# Altium schematic sheet untitled.SchDoc
size 209 x 148 mm
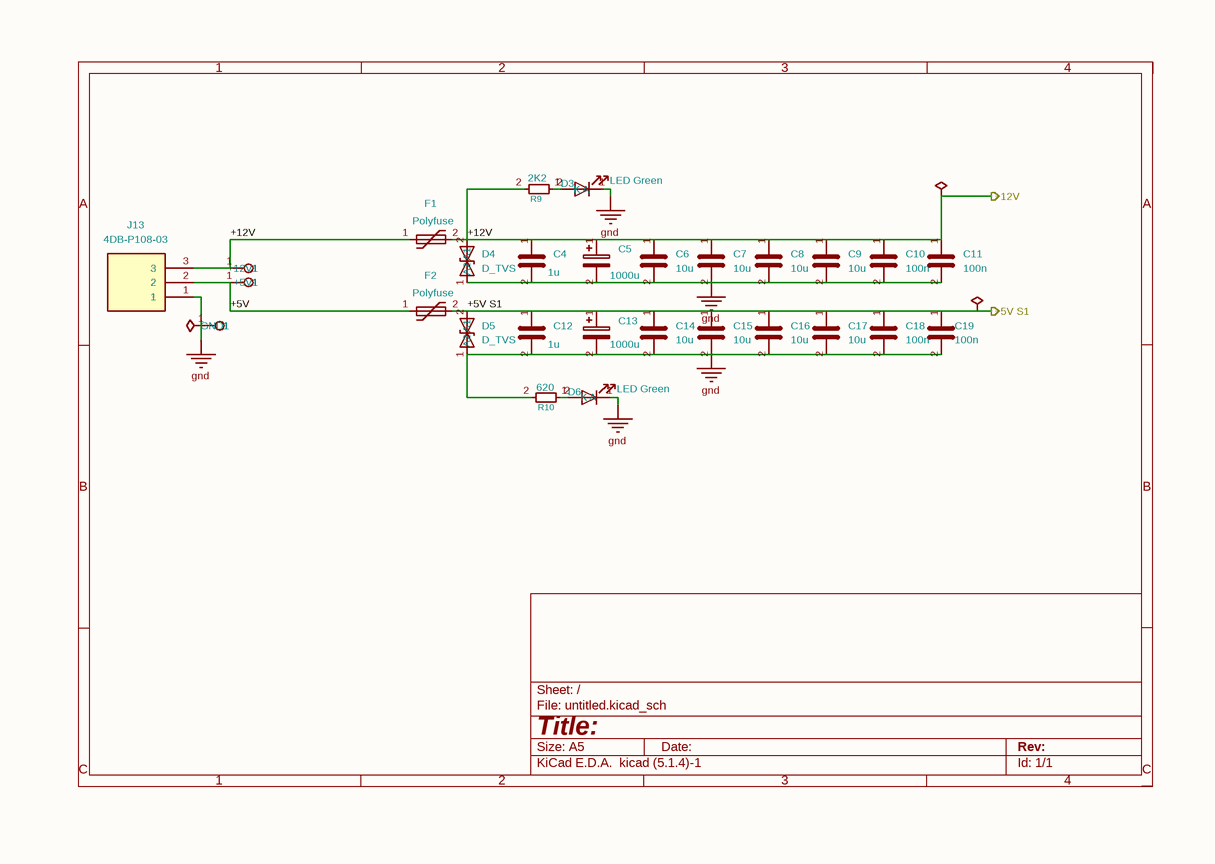
[diagram p0: untitled.SchDoc]

## Parts
#FLG01  PWR_FLAG  (value not drawn)  (graphical)
#FLG02  PWR_FLAG  (value not drawn)  (graphical)
#FLG03  PWR_FLAG  (value not drawn)  (graphical)
+5V1  TestPoint  [TestPoint_Pad_1.0x1.0mm]  (value not drawn)
+12V1  TestPoint  [TestPoint_Pad_1.0x1.0mm]  (value not drawn)
C4  1u  [C_1210_3225Metric]
C5  1000u  [EEE0JA152UAP]
C6  10u  [C_1210_3225Metric]
C7  10u  [C_1210_3225Metric]
C8  10u  [C_1210_3225Metric]
C9  10u  [C_1210_3225Metric]
C10  100n  [C_0402_1005Metric]
C11  100n  [C_0402_1005Metric]
C12  1u  [C_1210_3225Metric]
C13  1000u  [EEE0JA152UAP]
C14  10u  [C_1210_3225Metric]
C15  10u  [C_1210_3225Metric]
C16  10u  [C_1210_3225Metric]
C17  10u  [C_1210_3225Metric]
C18  100n  [C_0402_1005Metric]
C19  100n  [C_0402_1005Metric]
D3  LED Green  [LED_0603_1608Metric]
D4  D_TVS  [SMBJ12A]
D5  D_TVS  [SMBJ5.0A]
D6  LED Green  [LED_0603_1608Metric]
F1  Polyfuse  [RGEF1200]
F2  Polyfuse  [RGEF1200]
GND1  TestPoint  [TestPoint_Pad_1.0x1.0mm]  (value not drawn)
J13  4DB-P108-03  [4DBP10803]
R9  2K2  [R_0603_1608Metric]
R10  620  [R_0603_1608Metric]

## Ports
+5V S1 (out), +12V (out)

## Nets
gnd: #FLG03.1 C4.2 C5.2 C6.2 C7.2 C8.2 C9.2 C10.2 C11.2 C12.2 C13.2 C14.2 C15.2 C16.2 C17.2 C18.2 C19.2 D3.1(K) D4.1(A1) D5.1(A1) D6.1(K) GND1.1 J13.1 R10.2
+5V: +5V1.1 F2.1 J13.2
+5V S1: #FLG02.1 C12.1 C13.1 C14.1 C15.1 C16.1 C17.1 C18.1 C19.1 D5.2(A2) F2.2 ; port +5V S1
+12V: #FLG01.1 +12V1.1 C4.1 C5.1 C6.1 C7.1 C8.1 C9.1 C10.1 C11.1 D4.2(A2) F1.1 F1.2 J13.3 R9.2 ; port +12V
NetD3_2: D3.2(A) R9.1
NetD6_2: D6.2(A) R10.1

## Notes on the sheet
- 1
- 2
- 3
- 4
- A
- B
- Title:
- File: untitled.kicad_sch
- Sheet: /
- C
- KiCad E.D.A.  kicad (5.1.4)-1
- Size: A5
- Date:
- Rev:
- Id: 1/1

## Library data of the parts
#FLG01 #FLG02 #FLG03 = PWR_FLAG: Description: Special symbol for telling ERC where power comes from; Value: PWR_FLAG
C4 C6-C12 C14-C19 = C: Description: Unpolarized capacitor
  C4 C12: Value: 1u; Footprint: Capacitor_SMD:C_1210_3225Metric
  C6-C9 C14-C17: Value: 10u; Footprint: Capacitor_SMD:C_1210_3225Metric
  C10 C11 C18 C19: Value: 100n; Footprint: Capacitor_SMD:C_0402_1005Metric
C5 C13 = C_Polarized: Description: Polarized capacitor; Value: 1000u; Footprint: EEE0JA152UAP:EEE0JA152UAP
D3 D6 = LED: Part Description: Green 572nm LED Indication - Discrete 2.2V 2-SMD, No Lead; Field4: Digikey; Field5: LTST-S270KGKT; Field6: SML-A12M8TT86N; Field7: Rohm; Field8: 650263301; Value: LED Green; Footprint: LED_SMD:LED_0603_1608Metric
D4 D5 = D_TVS: Description: Bidirectional transient-voltage-suppression diode; Value: D_TVS
  D4: Footprint: SMBJ12A:SMBJ12A
  D5: Footprint: SMBJ5.0A:SMBJ5.0A
F1 F2 = Polyfuse: Description: Resettable fuse, polymeric positive temperature coefficient; Value: Polyfuse; Footprint: RGEF1200:RGEF1200
J13 = 4DB-P108-03: Manufacturer_Name: TE Connectivity; Description: Dual Barrier, Printed Circuit Pin, Wire-to-Board, 3 Position, 8.26 mm [.325 in] Centerline, 1 Row, Buchanan 4DB Series, Barrier Strips; Height: 13.589; Manufacturer_Part_Number: 4DB-P108-03; Mouser Part Number: 571-214376675; Mouser Price/Stock: https://www.mouser.co.uk/ProductDetail/TE-Connectivity/4DB-P108-03?qs=cX92MwKKzGt2YIn2dZcfJQ%3D%3D; Arrow Part Number: 4DB-P108-03; Arrow Price/Stock: https://www.arrow.com/en/products/4db-p108-03/te-connectivity?utm_currency=USD&region=nac; Value: 4DB-P108-03; Footprint: 4DB-P108-03:4DBP10803
R9 R10 = R_Small: Description: Resistor, small symbol; Footprint: Resistor_SMD:R_0603_1608Metric
  R9: Value: 2K2
  R10: Value: 620
+5V1 +12V1 GND1 = TestPoint: Description: test point; Value: TestPoint; Footprint: TestPoint:TestPoint_Pad_1.0x1.0mm